# Altium schematic sheet MB784.SchDoc
size A3; Revision: B.2(PCB.SCH)
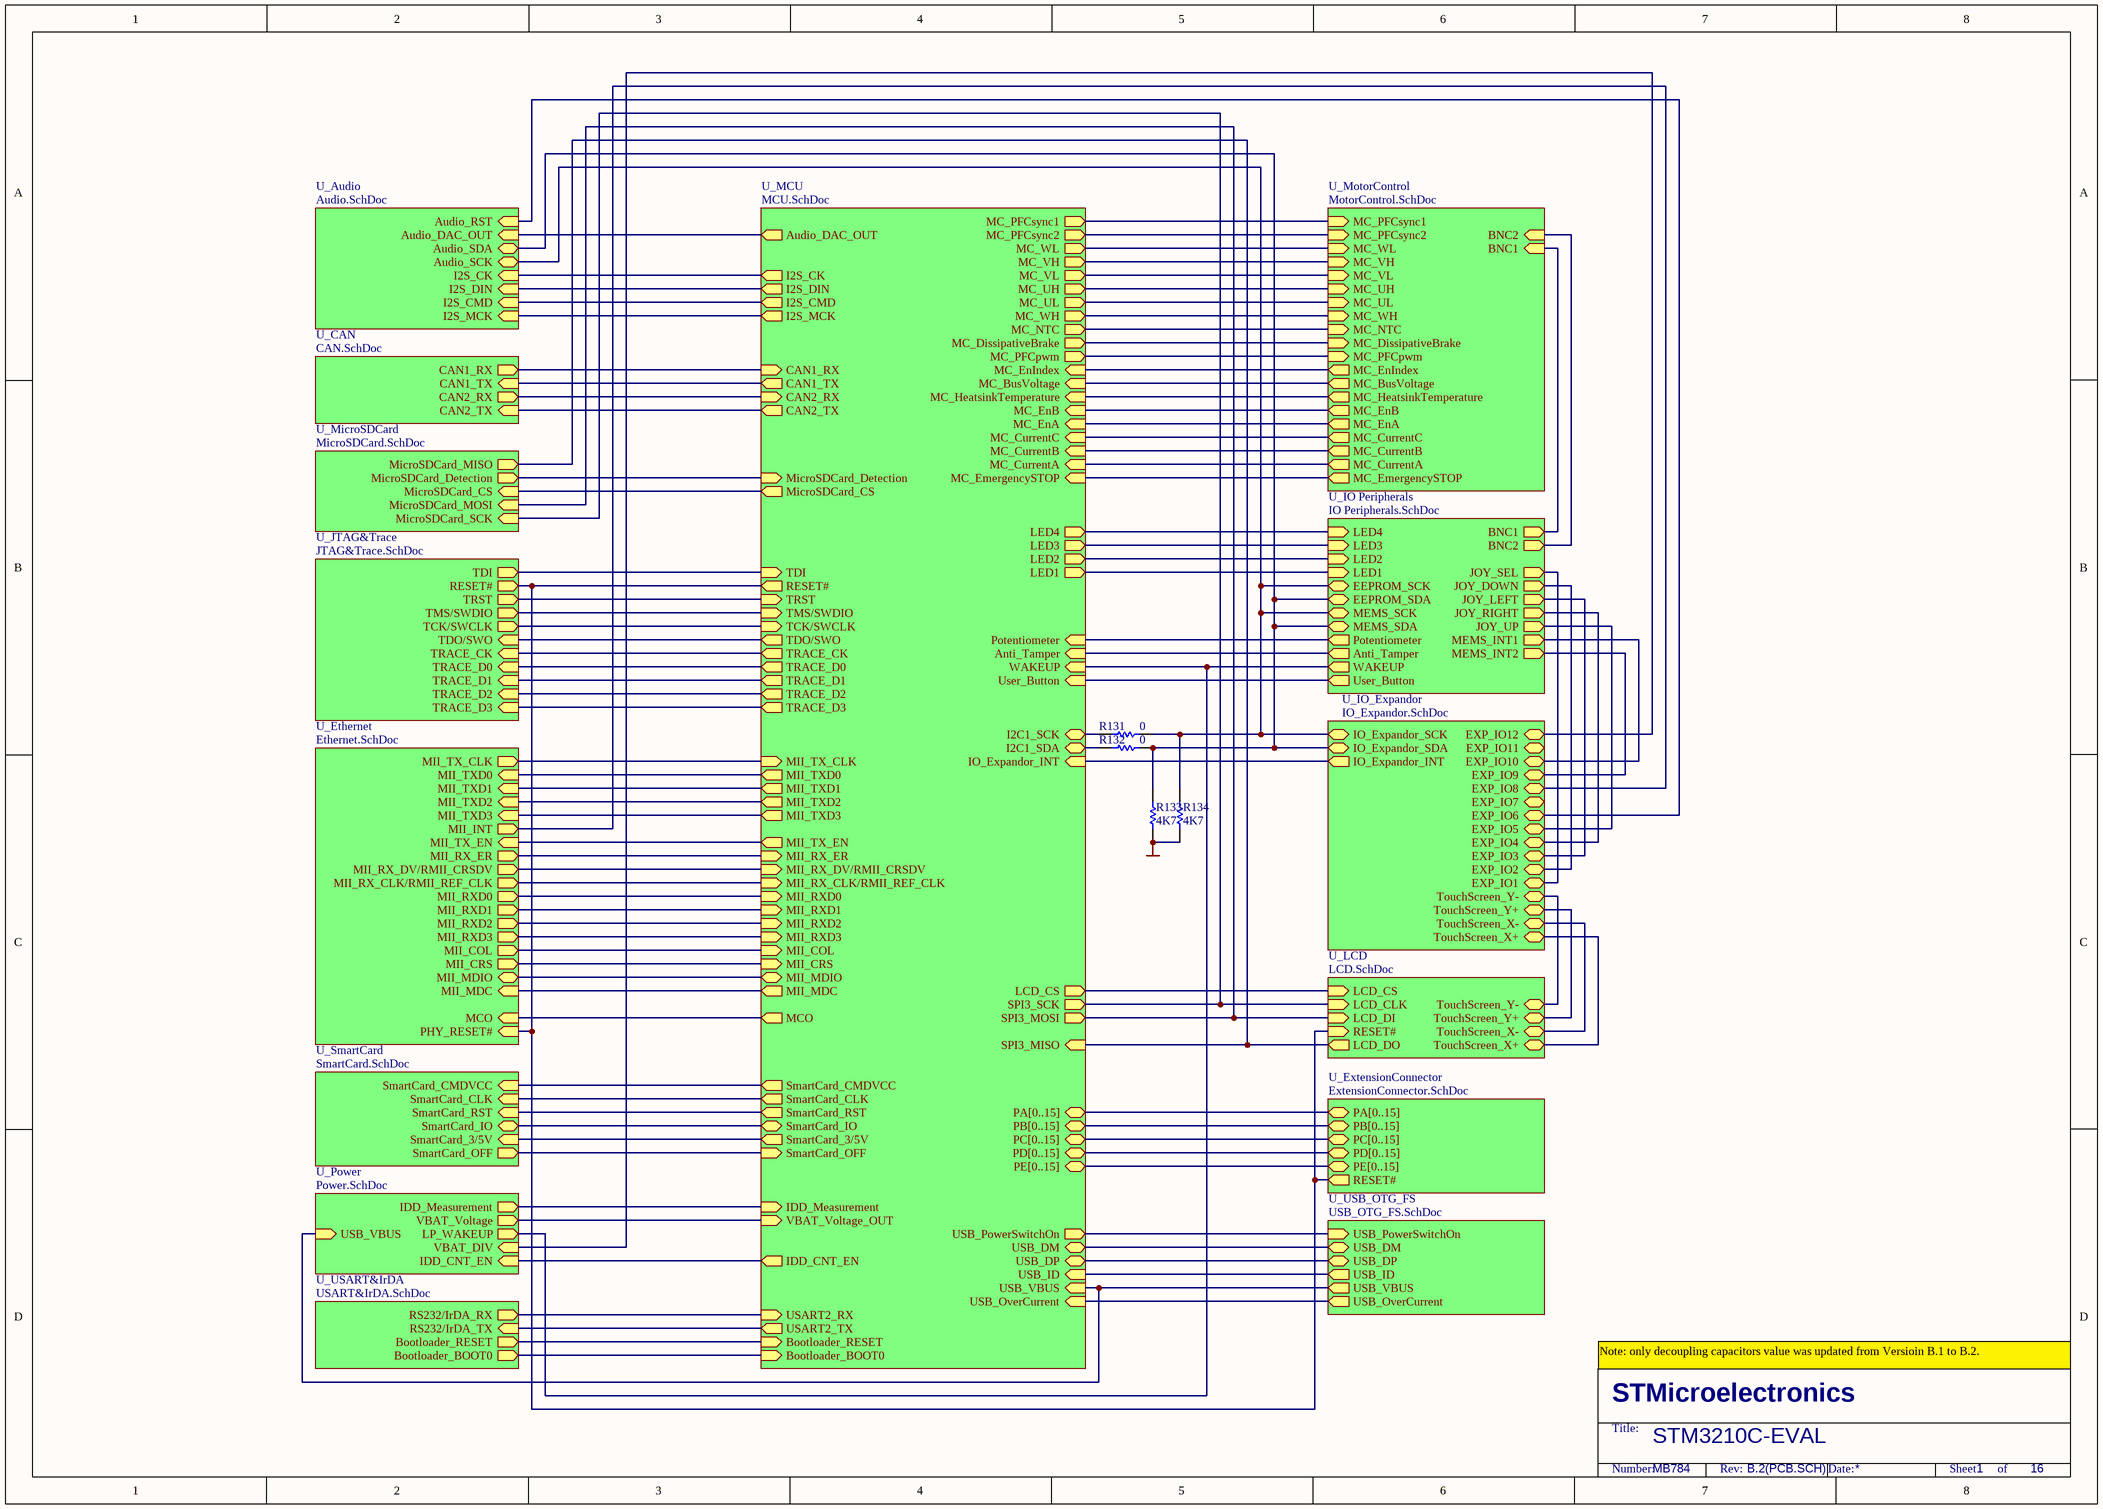
[diagram p0: MB784.SchDoc]

## Parts
R131  0  [0603R]
R132  0  [0603R]
R133  4K7  [0603R]
R134  4K7  [0603R]

## Sub-sheets
U_Audio = Audio.SchDoc: I2S_CMD (in), I2S_DIN (in), I2S_CK (in), Audio_SCK (bidir), Audio_SDA (bidir), Audio_RST (in), I2S_MCK (in), Audio_DAC_OUT (in)
U_CAN = CAN.SchDoc: CAN1_TX (in), CAN1_RX (out), CAN2_TX (in), CAN2_RX (out)
U_Ethernet = Ethernet.SchDoc: MII_TXD0 (in), MII_TX_EN (in), MII_TX_CLK (out), MII_RXD0 (out), MII_RX_ER (out), MII_RX_DV/RMII_CRSDV (out), MII_RX_CLK/RMII_REF_CLK (out), MII_COL (out), MII_CRS (out), MII_MDC (in), MII_MDIO (bidir), MCO (in), PHY_RESET# (in), MII_TXD1 (in), MII_TXD2 (in), MII_TXD3 (in), MII_RXD1 (out), MII_RXD2 (out), MII_RXD3 (out), MII_INT (out)
U_ExtensionConnector = ExtensionConnector.SchDoc: PA[0..15] (bidir), PB[0..15] (bidir), PC[0..15] (bidir), PD[0..15] (bidir), PE[0..15] (bidir), RESET# (out)
U_IO Peripherals = IO Peripherals.SchDoc: BNC1 (out), BNC2 (out), LED4 (in), LED3 (in), LED1 (in), LED2 (in), Potentiometer (out), JOY_SEL (out), JOY_DOWN (out), JOY_LEFT (out), JOY_RIGHT (out), JOY_UP (out), Anti_Tamper (out), WAKEUP (out), User_Button (out), EEPROM_SCK (bidir), EEPROM_SDA (bidir), MEMS_SCK (bidir), MEMS_SDA (bidir), MEMS_INT1 (out), MEMS_INT2 (out)
U_IO_Expandor = IO_Expandor.SchDoc: IO_Expandor_SCK (bidir), IO_Expandor_SDA (bidir), IO_Expandor_INT (out), TouchScreen_X+ (bidir), TouchScreen_X- (bidir), TouchScreen_Y+ (bidir), TouchScreen_Y- (bidir), EXP_IO2 (bidir), EXP_IO3 (bidir), EXP_IO4 (bidir), EXP_IO5 (bidir), EXP_IO6 (bidir), EXP_IO7 (bidir), EXP_IO8 (bidir), EXP_IO9 (bidir), EXP_IO10 (bidir), EXP_IO11 (bidir), EXP_IO12 (bidir), EXP_IO1 (bidir)
U_JTAG&Trace = JTAG&Trace.SchDoc: TDI (out), RESET# (out), TRACE_D3 (in), TRACE_D2 (in), TRACE_D1 (in), TRACE_D0 (in), TRACE_CK (in), TRST (out), TMS/SWDIO (out), TCK/SWCLK (out), TDO/SWO (in)
U_LCD = LCD.SchDoc: LCD_CS (in), LCD_CLK (in), LCD_DO (out), LCD_DI (in), RESET# (in), TouchScreen_X+ (bidir), TouchScreen_X- (bidir), TouchScreen_Y+ (bidir), TouchScreen_Y- (bidir)
U_MCU = MCU.SchDoc: USB_PowerSwitchOn (out), USB_VBUS (in), USB_DM (bidir), USB_DP (bidir), USB_ID (in), MII_TX_EN (out), MII_TX_CLK (in), MII_RX_ER (in), MII_RX_DV/RMII_CRSDV (in), MII_COL (in), MII_CRS (in), MII_MDC (out), MII_MDIO (bidir), IO_Expandor_INT (in), CAN1_TX (out), CAN1_RX (in), CAN2_TX (out), CAN2_RX (in), USART2_TX (out), USART2_RX (in), SmartCard_3/5V (out), SmartCard_IO (bidir), SmartCard_RST (out), SmartCard_CLK (out), SmartCard_OFF (in), SmartCard_CMDVCC (out), I2S_CMD (out), I2S_DIN (out), I2S_CK (out), I2C1_SCK (bidir), I2C1_SDA (bidir), I2S_MCK (out), MC_WL (out), MC_VH (out), MC_VL (out), MC_UH (out), MC_UL (out), MC_WH (out), MC_NTC (out), MC_DissipativeBrake (out), MC_PFCpwm (out), MC_EnA (in), MC_EnB (in), MC_HeatsinkTemperature (in), MC_BusVoltage (in), MC_EnIndex (in), MC_EmergencySTOP (in), MC_CurrentA (in), MC_CurrentB (in), MC_CurrentC (in), MC_PFCsync1 (out), MC_PFCsync2 (out), LCD_CS (out), RESET# (out), LED4 (out), LED3 (out), LED1 (out), LED2 (out), Potentiometer (in), Anti_Tamper (in), WAKEUP (in), User_Button (in), TDI (in), TRACE_D3 (out), TRACE_D2 (out), TRACE_D1 (out), TRACE_D0 (out), TRACE_CK (out), TRST (in), TMS/SWDIO (in), TCK/SWCLK (in), TDO/SWO (out), IDD_Measurement (in), IDD_CNT_EN (out), VBAT_Voltage_OUT (in), SPI3_SCK (out), SPI3_MISO (in), SPI3_MOSI (out), MicroSDCard_CS (out), USB_OverCurrent (in), MicroSDCard_Detection (in), PA[0..15] (bidir), PB[0..15] (bidir), PC[0..15] (bidir), PD[0..15] (bidir), PE[0..15] (bidir), MII_TXD0 (out), MII_RXD0 (in), MII_TXD1 (out), MII_TXD2 (out), MII_TXD3 (out), MII_RXD1 (in), MII_RXD2 (in), MII_RXD3 (in), MII_RX_CLK/RMII_REF_CLK (in), MCO (out), Bootloader_RESET (in), Bootloader_BOOT0 (in), Audio_DAC_OUT (out)
U_MicroSDCard = MicroSDCard.SchDoc: MicroSDCard_SCK (in), MicroSDCard_MISO (out), MicroSDCard_MOSI (in), MicroSDCard_CS (in), MicroSDCard_Detection (out)
U_MotorControl = MotorControl.SchDoc: MC_EmergencySTOP (out), MC_CurrentA (out), MC_CurrentB (out), MC_CurrentC (out), MC_PFCsync1 (in), MC_PFCsync2 (in), MC_WL (in), MC_VH (in), MC_VL (in), MC_UH (in), MC_UL (in), MC_WH (in), MC_NTC (in), MC_DissipativeBrake (in), MC_PFCpwm (in), MC_EnA (out), MC_EnB (out), MC_HeatsinkTemperature (out), MC_BusVoltage (out), MC_EnIndex (out), BNC1 (in), BNC2 (in)
U_Power = Power.SchDoc: IDD_Measurement (out), IDD_CNT_EN (in), VBAT_Voltage (out), LP_WAKEUP (out), VBAT_DIV (in), USB_VBUS (in)
U_SmartCard = SmartCard.SchDoc: SmartCard_3/5V (in), SmartCard_IO (bidir), SmartCard_RST (in), SmartCard_CLK (in), SmartCard_OFF (out), SmartCard_CMDVCC (in)
U_USART&IrDA = USART&IrDA.SchDoc: RS232/IrDA_TX (in), RS232/IrDA_RX (out), Bootloader_RESET (out), Bootloader_BOOT0 (out)
U_USB_OTG_FS = USB_OTG_FS.SchDoc: USB_PowerSwitchOn (in), USB_OverCurrent (out), USB_VBUS (out), USB_DM (bidir), USB_DP (bidir), USB_ID (out)

## Nets
+3V3: R133.1 R134.1
NetR131_1: R131.1 R134.2 ; sheet U_Audio/Audio_SCK, sheet U_IO Peripherals/EEPROM_SCK, sheet U_IO Peripherals/MEMS_SCK, sheet U_IO_Expandor/IO_Expandor_SCK
NetR131_2: R131.2 ; sheet U_MCU/I2C1_SCK
NetR132_1: R132.1 R133.2 ; sheet U_Audio/Audio_SDA, sheet U_IO Peripherals/EEPROM_SDA, sheet U_IO Peripherals/MEMS_SDA, sheet U_IO_Expandor/IO_Expandor_SDA
NetR132_2: R132.2 ; sheet U_MCU/I2C1_SDA
(unnamed): sheet U_Audio/I2S_CMD, sheet U_MCU/I2S_CMD
(unnamed): sheet U_Audio/I2S_DIN, sheet U_MCU/I2S_DIN
(unnamed): sheet U_Audio/I2S_CK, sheet U_MCU/I2S_CK
(unnamed): sheet U_Audio/Audio_RST, sheet U_IO_Expandor/EXP_IO6
(unnamed): sheet U_Audio/I2S_MCK, sheet U_MCU/I2S_MCK
(unnamed): sheet U_Audio/Audio_DAC_OUT, sheet U_MCU/Audio_DAC_OUT
(unnamed): sheet U_CAN/CAN1_TX, sheet U_MCU/CAN1_TX
(unnamed): sheet U_CAN/CAN1_RX, sheet U_MCU/CAN1_RX
(unnamed): sheet U_CAN/CAN2_TX, sheet U_MCU/CAN2_TX
(unnamed): sheet U_CAN/CAN2_RX, sheet U_MCU/CAN2_RX
(unnamed): sheet U_Ethernet/MII_TXD0, sheet U_MCU/MII_TXD0
(unnamed): sheet U_Ethernet/MII_TX_EN, sheet U_MCU/MII_TX_EN
(unnamed): sheet U_Ethernet/MII_TX_CLK, sheet U_MCU/MII_TX_CLK
(unnamed): sheet U_Ethernet/MII_RXD0, sheet U_MCU/MII_RXD0
(unnamed): sheet U_Ethernet/MII_RX_ER, sheet U_MCU/MII_RX_ER
(unnamed): sheet U_Ethernet/MII_RX_DV/RMII_CRSDV, sheet U_MCU/MII_RX_DV/RMII_CRSDV
(unnamed): sheet U_Ethernet/MII_RX_CLK/RMII_REF_CLK, sheet U_MCU/MII_RX_CLK/RMII_REF_CLK
(unnamed): sheet U_Ethernet/MII_COL, sheet U_MCU/MII_COL
(unnamed): sheet U_Ethernet/MII_CRS, sheet U_MCU/MII_CRS
(unnamed): sheet U_Ethernet/MII_MDC, sheet U_MCU/MII_MDC
(unnamed): sheet U_Ethernet/MII_MDIO, sheet U_MCU/MII_MDIO
(unnamed): sheet U_Ethernet/MCO, sheet U_MCU/MCO
(unnamed): sheet U_Ethernet/PHY_RESET#, sheet U_ExtensionConnector/RESET#, sheet U_JTAG&Trace/RESET#, sheet U_LCD/RESET#, sheet U_MCU/RESET#
(unnamed): sheet U_Ethernet/MII_TXD1, sheet U_MCU/MII_TXD1
(unnamed): sheet U_Ethernet/MII_TXD2, sheet U_MCU/MII_TXD2
(unnamed): sheet U_Ethernet/MII_TXD3, sheet U_MCU/MII_TXD3
(unnamed): sheet U_Ethernet/MII_RXD1, sheet U_MCU/MII_RXD1
(unnamed): sheet U_Ethernet/MII_RXD2, sheet U_MCU/MII_RXD2
(unnamed): sheet U_Ethernet/MII_RXD3, sheet U_MCU/MII_RXD3
(unnamed): sheet U_Ethernet/MII_INT, sheet U_IO_Expandor/EXP_IO8
(unnamed): sheet U_IO Peripherals/BNC1, sheet U_MotorControl/BNC1
(unnamed): sheet U_IO Peripherals/BNC2, sheet U_MotorControl/BNC2
(unnamed): sheet U_IO Peripherals/LED4, sheet U_MCU/LED4
(unnamed): sheet U_IO Peripherals/LED3, sheet U_MCU/LED3
(unnamed): sheet U_IO Peripherals/LED1, sheet U_MCU/LED1
(unnamed): sheet U_IO Peripherals/LED2, sheet U_MCU/LED2
(unnamed): sheet U_IO Peripherals/Potentiometer, sheet U_MCU/Potentiometer
(unnamed): sheet U_IO Peripherals/JOY_SEL, sheet U_IO_Expandor/EXP_IO1
(unnamed): sheet U_IO Peripherals/JOY_DOWN, sheet U_IO_Expandor/EXP_IO2
(unnamed): sheet U_IO Peripherals/JOY_LEFT, sheet U_IO_Expandor/EXP_IO3
(unnamed): sheet U_IO Peripherals/JOY_RIGHT, sheet U_IO_Expandor/EXP_IO4
(unnamed): sheet U_IO Peripherals/JOY_UP, sheet U_IO_Expandor/EXP_IO5
(unnamed): sheet U_IO Peripherals/Anti_Tamper, sheet U_MCU/Anti_Tamper
(unnamed): sheet U_IO Peripherals/WAKEUP, sheet U_MCU/WAKEUP, sheet U_Power/LP_WAKEUP
(unnamed): sheet U_IO Peripherals/User_Button, sheet U_MCU/User_Button
(unnamed): sheet U_IO Peripherals/MEMS_INT1, sheet U_IO_Expandor/EXP_IO10
(unnamed): sheet U_IO Peripherals/MEMS_INT2, sheet U_IO_Expandor/EXP_IO9
(unnamed): sheet U_JTAG&Trace/TDI, sheet U_MCU/TDI
(unnamed): sheet U_JTAG&Trace/TRACE_D3, sheet U_MCU/TRACE_D3
(unnamed): sheet U_JTAG&Trace/TRACE_D2, sheet U_MCU/TRACE_D2
(unnamed): sheet U_JTAG&Trace/TRACE_D1, sheet U_MCU/TRACE_D1
(unnamed): sheet U_JTAG&Trace/TRACE_D0, sheet U_MCU/TRACE_D0
(unnamed): sheet U_JTAG&Trace/TRACE_CK, sheet U_MCU/TRACE_CK
(unnamed): sheet U_JTAG&Trace/TRST, sheet U_MCU/TRST
(unnamed): sheet U_JTAG&Trace/TMS/SWDIO, sheet U_MCU/TMS/SWDIO
(unnamed): sheet U_JTAG&Trace/TCK/SWCLK, sheet U_MCU/TCK/SWCLK
(unnamed): sheet U_JTAG&Trace/TDO/SWO, sheet U_MCU/TDO/SWO
(unnamed): sheet U_LCD/LCD_CS, sheet U_MCU/LCD_CS
(unnamed): sheet U_LCD/LCD_CLK, sheet U_MCU/SPI3_SCK, sheet U_MicroSDCard/MicroSDCard_SCK
(unnamed): sheet U_LCD/LCD_DO, sheet U_MCU/SPI3_MISO, sheet U_MicroSDCard/MicroSDCard_MISO
(unnamed): sheet U_LCD/LCD_DI, sheet U_MCU/SPI3_MOSI, sheet U_MicroSDCard/MicroSDCard_MOSI
(unnamed): sheet U_LCD/TouchScreen_X+, sheet U_IO_Expandor/TouchScreen_X+
(unnamed): sheet U_LCD/TouchScreen_X-, sheet U_IO_Expandor/TouchScreen_X-
(unnamed): sheet U_LCD/TouchScreen_Y+, sheet U_IO_Expandor/TouchScreen_Y+
(unnamed): sheet U_LCD/TouchScreen_Y-, sheet U_IO_Expandor/TouchScreen_Y-
(unnamed): sheet U_MCU/USB_PowerSwitchOn, sheet U_USB_OTG_FS/USB_PowerSwitchOn
(unnamed): sheet U_MCU/USB_VBUS, sheet U_Power/USB_VBUS, sheet U_USB_OTG_FS/USB_VBUS
(unnamed): sheet U_MCU/USB_DM, sheet U_USB_OTG_FS/USB_DM
(unnamed): sheet U_MCU/USB_DP, sheet U_USB_OTG_FS/USB_DP
(unnamed): sheet U_MCU/USB_ID, sheet U_USB_OTG_FS/USB_ID
(unnamed): sheet U_MCU/IO_Expandor_INT, sheet U_IO_Expandor/IO_Expandor_INT
(unnamed): sheet U_MCU/USART2_TX, sheet U_USART&IrDA/RS232/IrDA_TX
(unnamed): sheet U_MCU/USART2_RX, sheet U_USART&IrDA/RS232/IrDA_RX
(unnamed): sheet U_MCU/SmartCard_3/5V, sheet U_SmartCard/SmartCard_3/5V
(unnamed): sheet U_MCU/SmartCard_IO, sheet U_SmartCard/SmartCard_IO
(unnamed): sheet U_MCU/SmartCard_RST, sheet U_SmartCard/SmartCard_RST
(unnamed): sheet U_MCU/SmartCard_CLK, sheet U_SmartCard/SmartCard_CLK
(unnamed): sheet U_MCU/SmartCard_OFF, sheet U_SmartCard/SmartCard_OFF
(unnamed): sheet U_MCU/SmartCard_CMDVCC, sheet U_SmartCard/SmartCard_CMDVCC
(unnamed): sheet U_MCU/MC_WL, sheet U_MotorControl/MC_WL
(unnamed): sheet U_MCU/MC_VH, sheet U_MotorControl/MC_VH
(unnamed): sheet U_MCU/MC_VL, sheet U_MotorControl/MC_VL
(unnamed): sheet U_MCU/MC_UH, sheet U_MotorControl/MC_UH
(unnamed): sheet U_MCU/MC_UL, sheet U_MotorControl/MC_UL
(unnamed): sheet U_MCU/MC_WH, sheet U_MotorControl/MC_WH
(unnamed): sheet U_MCU/MC_NTC, sheet U_MotorControl/MC_NTC
(unnamed): sheet U_MCU/MC_DissipativeBrake, sheet U_MotorControl/MC_DissipativeBrake
(unnamed): sheet U_MCU/MC_PFCpwm, sheet U_MotorControl/MC_PFCpwm
(unnamed): sheet U_MCU/MC_EnA, sheet U_MotorControl/MC_EnA
(unnamed): sheet U_MCU/MC_EnB, sheet U_MotorControl/MC_EnB
(unnamed): sheet U_MCU/MC_HeatsinkTemperature, sheet U_MotorControl/MC_HeatsinkTemperature
(unnamed): sheet U_MCU/MC_BusVoltage, sheet U_MotorControl/MC_BusVoltage
(unnamed): sheet U_MCU/MC_EnIndex, sheet U_MotorControl/MC_EnIndex
(unnamed): sheet U_MCU/MC_EmergencySTOP, sheet U_MotorControl/MC_EmergencySTOP
(unnamed): sheet U_MCU/MC_CurrentA, sheet U_MotorControl/MC_CurrentA
(unnamed): sheet U_MCU/MC_CurrentB, sheet U_MotorControl/MC_CurrentB
(unnamed): sheet U_MCU/MC_CurrentC, sheet U_MotorControl/MC_CurrentC
(unnamed): sheet U_MCU/MC_PFCsync1, sheet U_MotorControl/MC_PFCsync1
(unnamed): sheet U_MCU/MC_PFCsync2, sheet U_MotorControl/MC_PFCsync2
(unnamed): sheet U_MCU/IDD_Measurement, sheet U_Power/IDD_Measurement
(unnamed): sheet U_MCU/IDD_CNT_EN, sheet U_Power/IDD_CNT_EN
(unnamed): sheet U_MCU/VBAT_Voltage_OUT, sheet U_Power/VBAT_Voltage
(unnamed): sheet U_MCU/MicroSDCard_CS, sheet U_MicroSDCard/MicroSDCard_CS
(unnamed): sheet U_MCU/USB_OverCurrent, sheet U_USB_OTG_FS/USB_OverCurrent
(unnamed): sheet U_MCU/MicroSDCard_Detection, sheet U_MicroSDCard/MicroSDCard_Detection
(unnamed): sheet U_MCU/Bootloader_RESET, sheet U_USART&IrDA/Bootloader_RESET
(unnamed): sheet U_MCU/Bootloader_BOOT0, sheet U_USART&IrDA/Bootloader_BOOT0
(unnamed): sheet U_Power/VBAT_DIV, sheet U_IO_Expandor/EXP_IO12

## Buses and harness runs
bus sheet U_ExtensionConnector/PA[0..15] = sheet U_MCU/PA[0..15]
bus sheet U_ExtensionConnector/PB[0..15] = sheet U_MCU/PB[0..15]
bus sheet U_ExtensionConnector/PC[0..15] = sheet U_MCU/PC[0..15]
bus sheet U_ExtensionConnector/PD[0..15] = sheet U_MCU/PD[0..15]
bus sheet U_ExtensionConnector/PE[0..15] = sheet U_MCU/PE[0..15]

## Notes on the sheet
- Note: only decoupling capacitors value was updated from Versioin B.1 to B.2.
- STM3210C-EVAL
- MB784
- 1
- 16
- STMicroelectronics
- Title:
- Number:
- Rev:
- Date:
- Sheet       of

## Library data of the parts
R131-R134 = Res1: Resistor; Value: 1K; Published: 8-Jun-2000; Revision: July-2002: Re-released for DXP Platform.; Publisher: Altium Limited